# Altium schematic sheet 05_LMS7002M_Misc.SchDoc: LMS7002M misc
size A3; Organization: Lime Microsystems; Address1: Surrey Tech Centre; Address2: Guildford GU2 7YG; Address3: Surrey; Address4: United Kingdom; Revision: v2.1; SheetNumber: 5; SheetTotal: 15
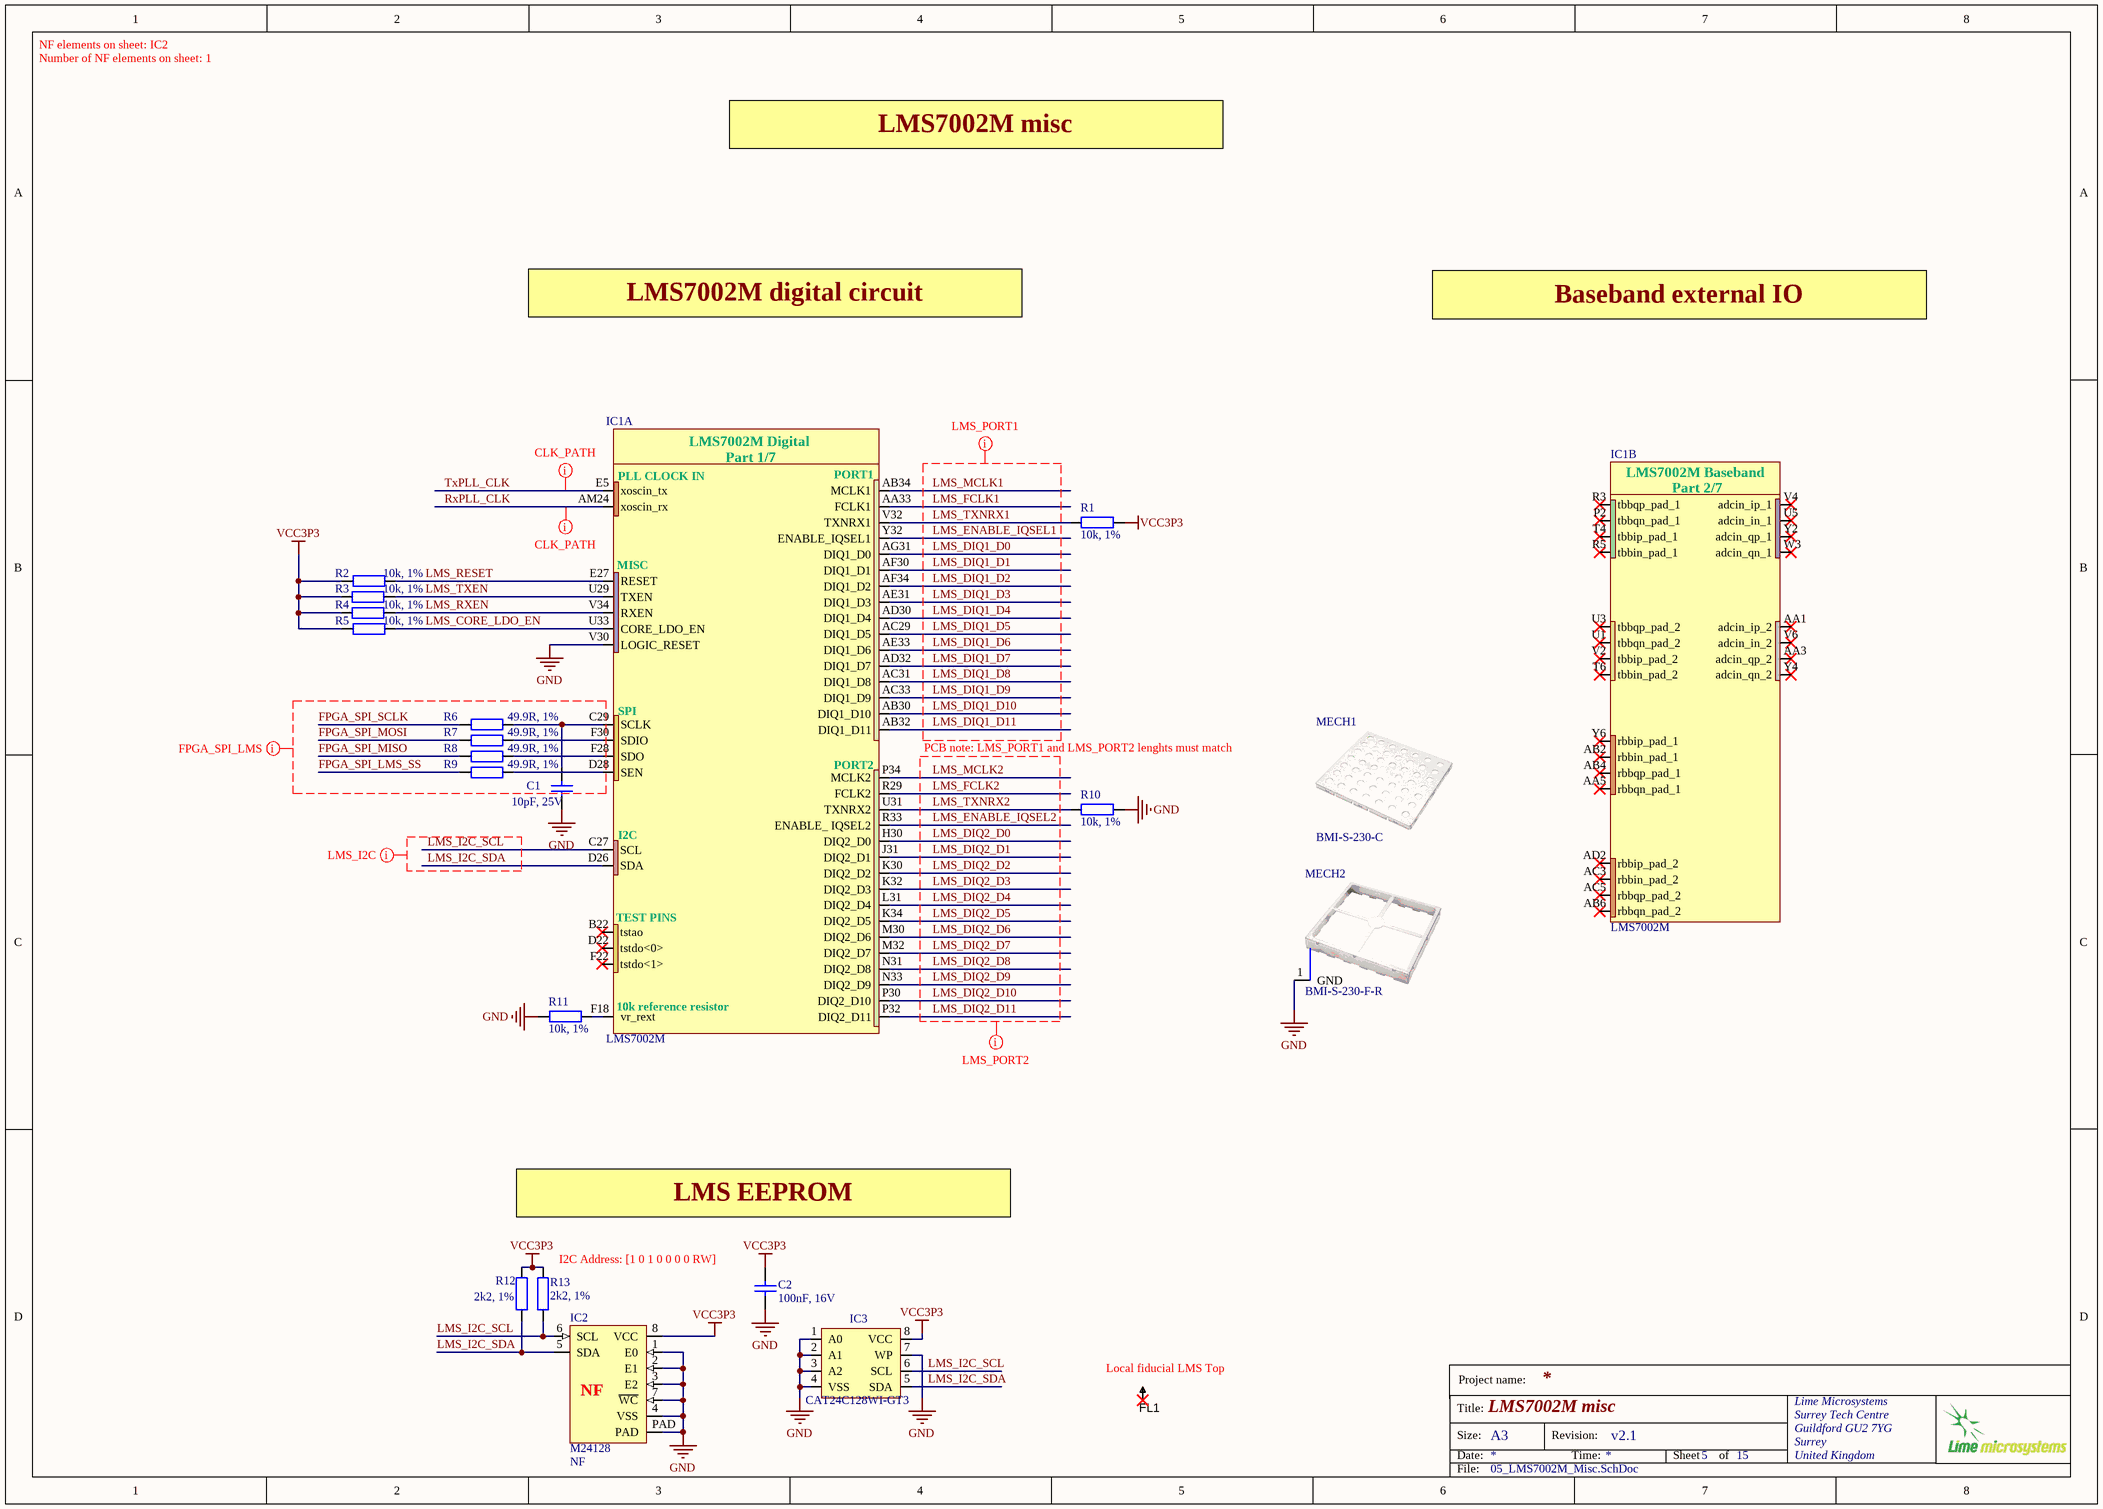
[diagram p0: 05_LMS7002M_Misc.SchDoc]

## Parts
C1  10pF, 25V  [CAP0402]
C2  100nF, 16V  [CAP0402]
FL1  Fiducial  [Fiducial_local]  (value not drawn)
IC1  LMS7002M  [LMS7002M_v5]  (parts A,B of 7)
IC2  M24128  Assembly Info: NF  [M24128-DFMC6TG]
IC3  CAT24C128WI-GT3  [SOIC127P600-8DL_v2]
MECH1  BMI-S-230-C  (mechanical)
MECH2  BMI-S-230-F-R  [RFI_SHIELD_BMI-S-230-F-R]
R1  10k, 1%  [RES0402]
R2  10k, 1%  [RES0402]
R3  10k, 1%  [RES0402]
R4  10k, 1%  [RES0402]
R5  10k, 1%  [RES0402]
R6  49.9R, 1%  [RES0402]
R7  49.9R, 1%  [RES0402]
R8  49.9R, 1%  [RES0402]
R9  49.9R, 1%  [RES0402]
R10  10k, 1%  [RES0402]
R11  10k, 1%  [RES0402]
R12  2k2, 1%  [RES0402]
R13  2k2, 1%  [RES0402]

## Nets
GND: C1.2 C2.2 IC1.V30(LOGIC_RESET) IC2.1(E0) IC2.2(E1) IC2.3(E2) IC2.4(VSS) IC2.7(~{WC}) IC2.PAD IC3.1(A0) IC3.2(A1) IC3.3(A2) IC3.4(VSS) IC3.7(WP) MECH2.1(GND) R10.2 R11.2
VCC3P3: C2.1 IC2.8(VCC) IC3.8(VCC) R1.2 R2.2 R3.1 R4.1 R5.2 R12.1 R13.1
FPGA_SPI_LMS_SS: R9.2
FPGA_SPI_MISO: R8.2
FPGA_SPI_MOSI: R7.2
FPGA_SPI_SCLK: R6.2
LMS_CORE_LDO_EN: IC1.U33(CORE_LDO_EN) R5.1
LMS_DIQ1_D0: IC1.AG31(DIQ1_D0)
LMS_DIQ1_D1: IC1.AF30(DIQ1_D1)
LMS_DIQ1_D2: IC1.AF34(DIQ1_D2)
LMS_DIQ1_D3: IC1.AE31(DIQ1_D3)
LMS_DIQ1_D4: IC1.AD30(DIQ1_D4)
LMS_DIQ1_D5: IC1.AC29(DIQ1_D5)
LMS_DIQ1_D6: IC1.AE33(DIQ1_D6)
LMS_DIQ1_D7: IC1.AD32(DIQ1_D7)
LMS_DIQ1_D8: IC1.AC31(DIQ1_D8)
LMS_DIQ1_D9: IC1.AC33(DIQ1_D9)
LMS_DIQ1_D10: IC1.AB30(DIQ1_D10)
LMS_DIQ1_D11: IC1.AB32(DIQ1_D11)
LMS_DIQ2_D0: IC1.H30(DIQ2_D0)
LMS_DIQ2_D1: IC1.J31(DIQ2_D1)
LMS_DIQ2_D2: IC1.K30(DIQ2_D2)
LMS_DIQ2_D3: IC1.K32(DIQ2_D3)
LMS_DIQ2_D4: IC1.L31(DIQ2_D4)
LMS_DIQ2_D5: IC1.K34(DIQ2_D5)
LMS_DIQ2_D6: IC1.M30(DIQ2_D6)
LMS_DIQ2_D7: IC1.M32(DIQ2_D7)
LMS_DIQ2_D8: IC1.N31(DIQ2_D8)
LMS_DIQ2_D9: IC1.N33(DIQ2_D9)
LMS_DIQ2_D10: IC1.P30(DIQ2_D10)
LMS_DIQ2_D11: IC1.P32(DIQ2_D11)
LMS_ENABLE_IQSEL1: IC1.Y32(ENABLE_IQSEL1)
LMS_ENABLE_IQSEL2: IC1.R33(ENABLE__IQSEL2)
LMS_FCLK1: IC1.AA33(FCLK1)
LMS_FCLK2: IC1.R29(FCLK2)
LMS_I2C_SCL: IC1.C27(SCL) IC2.6(SCL) IC3.6(SCL) R13.2
LMS_I2C_SDA: IC1.D26(SDA) IC2.5(SDA) IC3.5(SDA) R12.2
LMS_MCLK1: IC1.AB34(MCLK1)
LMS_MCLK2: IC1.P34(MCLK2)
LMS_RESET: IC1.E27(RESET) R2.1
LMS_RXEN: IC1.V34(RXEN) R4.2
LMS_TXEN: IC1.U29(TXEN) R3.2
LMS_TXNRX1: IC1.V32(TXNRX1) R1.1
LMS_TXNRX2: IC1.U31(TXNRX2) R10.1
RxPLL_CLK: IC1.AM24(xoscin_rx)
TxPLL_CLK: IC1.E5(xoscin_tx)
NetC1_1: C1.1 IC1.C29(SCLK) R6.1
NetIC1_D28: IC1.D28(SEN) R9.1
NetIC1_F18: IC1.F18(vr_rext) R11.1
NetIC1_F28: IC1.F28(SDO) R8.1
NetIC1_F30: IC1.F30(SDIO) R7.1

Not connected (* = marked no-connect by the designer): FL1 1*; IC1 AA1(adcin_ip_2)* AA3(adcin_qp_2)* AA5(rbbqn_pad_1)* AB2(rbbin_pad_1)* AB4(rbbqp_pad_1)* AB6(rbbqn_pad_2)* AC3(rbbin_pad_2)* AC5(rbbqp_pad_2)* AD2(rbbip_pad_2)* B22(tstao)* D22(tstdo<0>)* F22(tstdo<1>)* P2(tbbqn_pad_1)* R3(tbbqp_pad_1)* R5(tbbin_pad_1)* T4(tbbip_pad_1)* T6(tbbin_pad_2)* U1(tbbqn_pad_2)* U3(tbbqp_pad_2)* U5(adcin_in_1)* V2(tbbip_pad_2)* V4(adcin_ip_1)* V6(adcin_in_2)* W3(adcin_qn_1)* Y2(adcin_qp_1)* Y4(adcin_qn_2)* Y6(rbbip_pad_1)*

## Layout directives
net class CLK_PATH: RxPLL_CLK, TxPLL_CLK
net class FPGA_SPI_LMS: FPGA_SPI_LMS_SS, FPGA_SPI_MISO, FPGA_SPI_MOSI, FPGA_SPI_SCLK
net class LMS_I2C: LMS_I2C_SCL, LMS_I2C_SDA
net class LMS_PORT1: LMS_DIQ1_D0, LMS_DIQ1_D1, LMS_DIQ1_D2, LMS_DIQ1_D3, LMS_DIQ1_D4, LMS_DIQ1_D5, LMS_DIQ1_D6, LMS_DIQ1_D7, LMS_DIQ1_D8, LMS_DIQ1_D9, LMS_DIQ1_D10, LMS_DIQ1_D11, LMS_ENABLE_IQSEL1, LMS_FCLK1, LMS_MCLK1, LMS_TXNRX1
net class LMS_PORT2: LMS_DIQ2_D0, LMS_DIQ2_D1, LMS_DIQ2_D2, LMS_DIQ2_D3, LMS_DIQ2_D4, LMS_DIQ2_D5, LMS_DIQ2_D6, LMS_DIQ2_D7, LMS_DIQ2_D8, LMS_DIQ2_D9, LMS_DIQ2_D10, LMS_DIQ2_D11, LMS_ENABLE_IQSEL2, LMS_FCLK2, LMS_MCLK2, LMS_TXNRX2

## Notes on the sheet
- NF elements on sheet: IC2
- Number of NF elements on sheet: 1
- LMS7002M misc
- LMS7002M digital circuit
- Baseband external IO
- PCB note: LMS_PORT1 and LMS_PORT2 lenghts must match
- LMS EEPROM
- I2C Address: [1 0 1 0 0 0 0 RW]
- (near IC2) NF
- (near FL1) Local fiducial LMS Top
- Project name:
- Title:
- Size:
- Date:
- A3
- Revision:
- Time:
- Sheet
- of
- File:
- (in symbol LMS7002Mr3, part A) LMS7002M Digital; Part 1/7; PLL CLOCK IN; PORT1; MISC; SPI; PORT2; I2C; TEST PINS; 10k reference resistor
- (in symbol LMS7002Mr3, part B) LMS7002M Baseband; Part 2/7

## Library data of the parts
C1 = Cap_0402: Manufacturer Part Number 1: 04023A100JAT2A; Manufacturer: AVX; Part Description: 10pF ±5% 25V C0G, NP0 Ceramic Capacitor -55°C ~ 125°C Surface Mount, MLCC 0402 (1005 Metric) 0.039" L x 0.020" W (1.00mm x 0.50mm); Capacitance Tolerance: ± 5%; Voltage Rating: 25; Ceramic Capacitor Case: 0402 [1005 Metric]; Capacitor Case Style: 0402 [1005 Metric]<!--FANDB--><div class="features-and-benefits-container"></div>; Dielectric Characteristic: C0G / NP0; SVHC: No SVHC (16-Jun-2014); Capacitance: 10; Value: 10pF, 25V; Supplier 1: Farnell; Supplier Part Number 1: 2332478RL; Product Range: -; RoHS: YES; Operating Temperature Min: -55; Operating Temperature Max: 125; Capacitance Tolerance ±: ± 5%; MSL: MSL 1 - Unlimited; Packaging: Cut Tape
C2 = Cap_0603: Manufacturer Part Number 1: GRM155R71C104KA88D; Part Description: CAP CER 0.1UF 16V X7R 0402; Brand: Murata Electronics; Tolerance: 10 %; Type: General Purpose MLCC; Capacitance: 0.1 uF; Temperature Coefficient / Code: +/- 15 %; Supplier 1: Mouser; Supplier Part Number 1: 81-GRM155R71C104KA88; Case Code - in: 0402; Manufacturer: Murata Electronics; Category: Multilayer Ceramic Capacitors MLCC - SMD/SMT; Voltage Rating DC: 16 V; Value: 100nF, 16V; Maximum Operating Temperature: + 125 C; Minimum Operating Temperature: - 55 C; Minimum Order Quantity: 1; Operating Temperature Range: - 55 C to + 125 C; Package / Case: 0402 (1005 metric); Packaging: Reel; Product: General Type MLCCs; Product Category: Low & Medium Capacitance SMD Ceramic Chip Capacitors; Reeling: True; RoHS - Mouser: Y; RoHS: RoHS Compliant; Series: GRM; Standard Pack Qty: 10000; Termination Style: SMD/SMT
IC1 = LMS7002Mr3: Schematic symbol revision 3. Default footprint - 0.31mm pad; Manufacturer: Lime Microsystems; Part Description: IC FPRF Transceiver LMS7002M; 261 pin aQFN; Supplier 1: Lime Microsystems; Supplier Part Number 1: LMS7002M; Manufacturer Part Number 1: LMS7002M
IC2 = M24128-DFMC6TG: Manufacturer: STMicroelectronics; Part Description: EEPROM Memory IC 128Kb (16K x 8) I²C 1MHz 450ns 8-UFDFPN (2x3); Memory Type: Non-Volatile; Memory Format: EEPROM; Memory Size: 128Kb (16K x 8); Write Cycle Time - Word, Page: 5ms; Memory Interface: I²C; Voltage - Supply: 1.7 V ~ 5.5 V; Supplier 1: Digi-Key; Manufacturer Part Number 1: M24128-DFMC6TG; RoHS: RoHS Compliant; Category: Integrated Circuits (ICs); Stock 1: 5894; Pricing 1: 1=0.35, 10=0.348, 100=0.2854, 500=0.27748, 1000=0.27004 (USD); Packaging: Cut Tape (CT); Part Status: Active; Technology: EEPROM; Operating Temperature: -40°C ~ 85°C (TA); Mounting Type: Surface Mount; Package / Case: 8-UFDFN Exposed Pad; Supplier Device Package: 8-UFDFPN (2x3); ComponentLink1URL: http://www.st.com/content/ccc/resource/technical/document/datasheet/59/05/c9/5b/7b/41/48/b6/CD00259167.pdf/files/CD00259167.pdf/jcr:content/translations/en.CD00259167.pdf; ComponentLink1Description: http://www.st.com/content/ccc/resource/technical/document/datasheet/59/05/c9/5b/7b/41/48/b6/CD00259167.pdf/files/CD00259167.pdf/jcr:content/translations/en.CD00259167.pdf; Supplier Part Number 1: 497-15739-1-ND
IC3 = 24FC64F: Part Description: EEPROM Memory IC 128Kb (16K x 8) I²C 1MHz 400ns 8-SOIC; Manufacturer: ON Semiconductor; Memory Type: Non-Volatile; Memory Format: EEPROM; Memory Size: 128Kb (16K x 8); Write Cycle Time - Word, Page: 5ms; Memory Interface: I²C; Voltage - Supply: 1.8 V ~ 5.5 V; Supplier 1: Digi-Key; Supplier Part Number 1: CAT24C128WI-GT3CT-ND; Manufacturer Part Number 1: CAT24C128WI-GT3; RoHS: RoHS Compliant; Category: Integrated Circuits (ICs); Stock 1: 14804; Pricing 1: 1=0.31, 10=0.309, 100=0.2532, 500=0.24616, 1000=0.23956 (USD); Packaging: Cut Tape (CT); Part Status: Active; Technology: EEPROM; Operating Temperature: -40°C ~ 85°C (TA); Mounting Type: Surface Mount; Package / Case: 8-SOIC (0.154", 3.90mm Width); Supplier Device Package: 8-SOIC; Base Part Number: CAT24C128; ComponentLink1URL: http://www.onsemi.com/pub/Collateral/CAT24C128-D.PDF; ComponentLink1Description: http://www.onsemi.com/pub/Collateral/CAT24C128-D.PDF
MECH1 = RFI_SHIELD_2_cover: Part Description: RF Shield Cover 2.000" (50.80mm) X 1.500" (38.10mm) Vent Holes in Pattern Snap Fit; Manufacturer: Laird Technologies EMI; Ventilation: Vent Holes in Pattern; Supplier 1: Digi-Key; Supplier Part Number 1: 903-1471-ND; Manufacturer Part Number 1: BMI-S-230-C; RoHS: RoHS Compliant; Category: RF/IF and RFID; Stock 1: 15865; Pricing 1: 1=1.51, 10=1.333, 25=1.2044, 100=1.0537, 250=0.92472, 500=0.8172, 1000=0.64515, 2500=0.60214, 5000=0.57203 (USD); Packaging: Bulk; Part Status: Active; Type: Cover; Height - Overall: 0.200" (5.08mm); Length - Overall: 1.500" (38.10mm); Width - Overall: 2.000" (50.80mm); Mounting Type: Snap Fit; ComponentLink1URL: https://media.digikey.com/pdf/Data%20Sheets/Laird%20Technologies/BMI-S-230-C_Dwg.pdf; ComponentLink1Description: https://media.digikey.com/pdf/Data%20Sheets/Laird%20Technologies/BMI-S-230-C_Dwg.pdf
MECH2 = RFI_SHIELD_2_frame: Part Description: RF Shield Frame 2.000" (50.80mm) X 1.500" (38.10mm) Solder; Manufacturer: Laird Technologies EMI; Supplier 1: Digi-Key; Supplier Part Number 1: 903-1470-1-ND; Manufacturer Part Number 1: BMI-S-230-F-R; RoHS: RoHS Compliant; Category: RF/IF and RFID; Stock 1: 12638; Pricing 1: 1=1.95, 10=1.726, 25=1.5588 (USD); Packaging: Cut Tape (CT); Part Status: Active; Type: Frame; Height - Overall: 0.200" (5.08mm); Length - Overall: 1.500" (38.10mm); Width - Overall: 2.000" (50.80mm); Ventilation: -; Mounting Type: Solder; ComponentLink1URL: https://media.digikey.com/pdf/Data%20Sheets/Laird%20Technologies/BMI-S-230-F_Dwg.pdf; ComponentLink1Description: https://media.digikey.com/pdf/Data%20Sheets/Laird%20Technologies/BMI-S-230-F_Dwg.pdf
R1-R5 R10 R11 = Res_0402: Manufacturer: Yageo; Manufacturer Part Number 1: RC0402FR-0710KL; Part Description: RES SMD 10K OHM 1% 1/16W 0402; Temperature Coefficient: ±100ppm/°C; Power (Watts): 0.063W, 1/16W; Value: 10k, 1%; Supplier 1: Digi-Key; Supplier Part Number 1: 311-10.0KLRTR-ND; Resistance (Ohms): 10k; Packaging: Tape & Reel (TR); RoHS: RoHS Compliant; Package / Case: 0402 (1005 Metric); Tolerance: ±1%; Operating Temperature: -55°C ~ 155°C; Size / Dimension: 0.039" L x 0.020" W (1.00mm x 0.50mm); Number of Terminations: 2; Category: Resistors; Height: 0.016" (0.40mm); Supplier Device Package: 0402; Features: Moisture Resistant; Composition: Thick Film
R6-R9 = Res_0402: Manufacturer: Samsung Electro-Mechanics America, Inc.; Part Description: RES SMD 49.9 OHM 1% 1/16W 0402; Manufacturer Part Number 1: RC1005F49R9CS; Temperature Coefficient: ±100ppm/°C; Resistance (Ohms): 49.9; Power (Watts): 0.063W, 1/16W; Number of Terminations: 2; Size / Dimension: 0.039" L x 0.020" W (1.00mm x 0.50mm); Supplier Device Package: 0402 (1005 Metric); RoHS: RoHS Compliant; Supplier Part Number 1: 1276-3469-6-ND; Features: -; Packaging: Digi-Reel®; Tolerance: ±1%; Height: 0.016" (0.40mm); Category: Resistors; Composition: Thick Film; Package / Case: 0402 (1005 Metric); Supplier 1: Digi-Key; Operating Temperature: -55°C ~ 155°C; Value: 49.9R, 1%
R12 R13 = Res_0402: Manufacturer: Stackpole Electronics Inc; Manufacturer Part Number 1: RMCF0402FT2K20; Part Description: RES SMD 2.2K OHM 1% 1/16W 0402; Resistance (Ohms): 2.2k; Temperature Coefficient: ±100ppm/°C; Power (Watts): 0.063W, 1/16W; Value: 2k2, 1%; Supplier 1: Digi-Key; Supplier Part Number 1: RMCF0402FT2K20CT-ND; Supplier Device Package: 0402; Package / Case: 0402 (1005 Metric); Size / Dimension: 0.039" L x 0.020" W (1.00mm x 0.50mm); Operating Temperature: -55°C ~ 155°C; Composition: Thick Film; Category: Resistors; Features: -; Height: 0.016" (0.40mm); RoHS: RoHS Compliant; Number of Terminations: 2; Packaging: Cut Tape (CT); Tolerance: ±1%